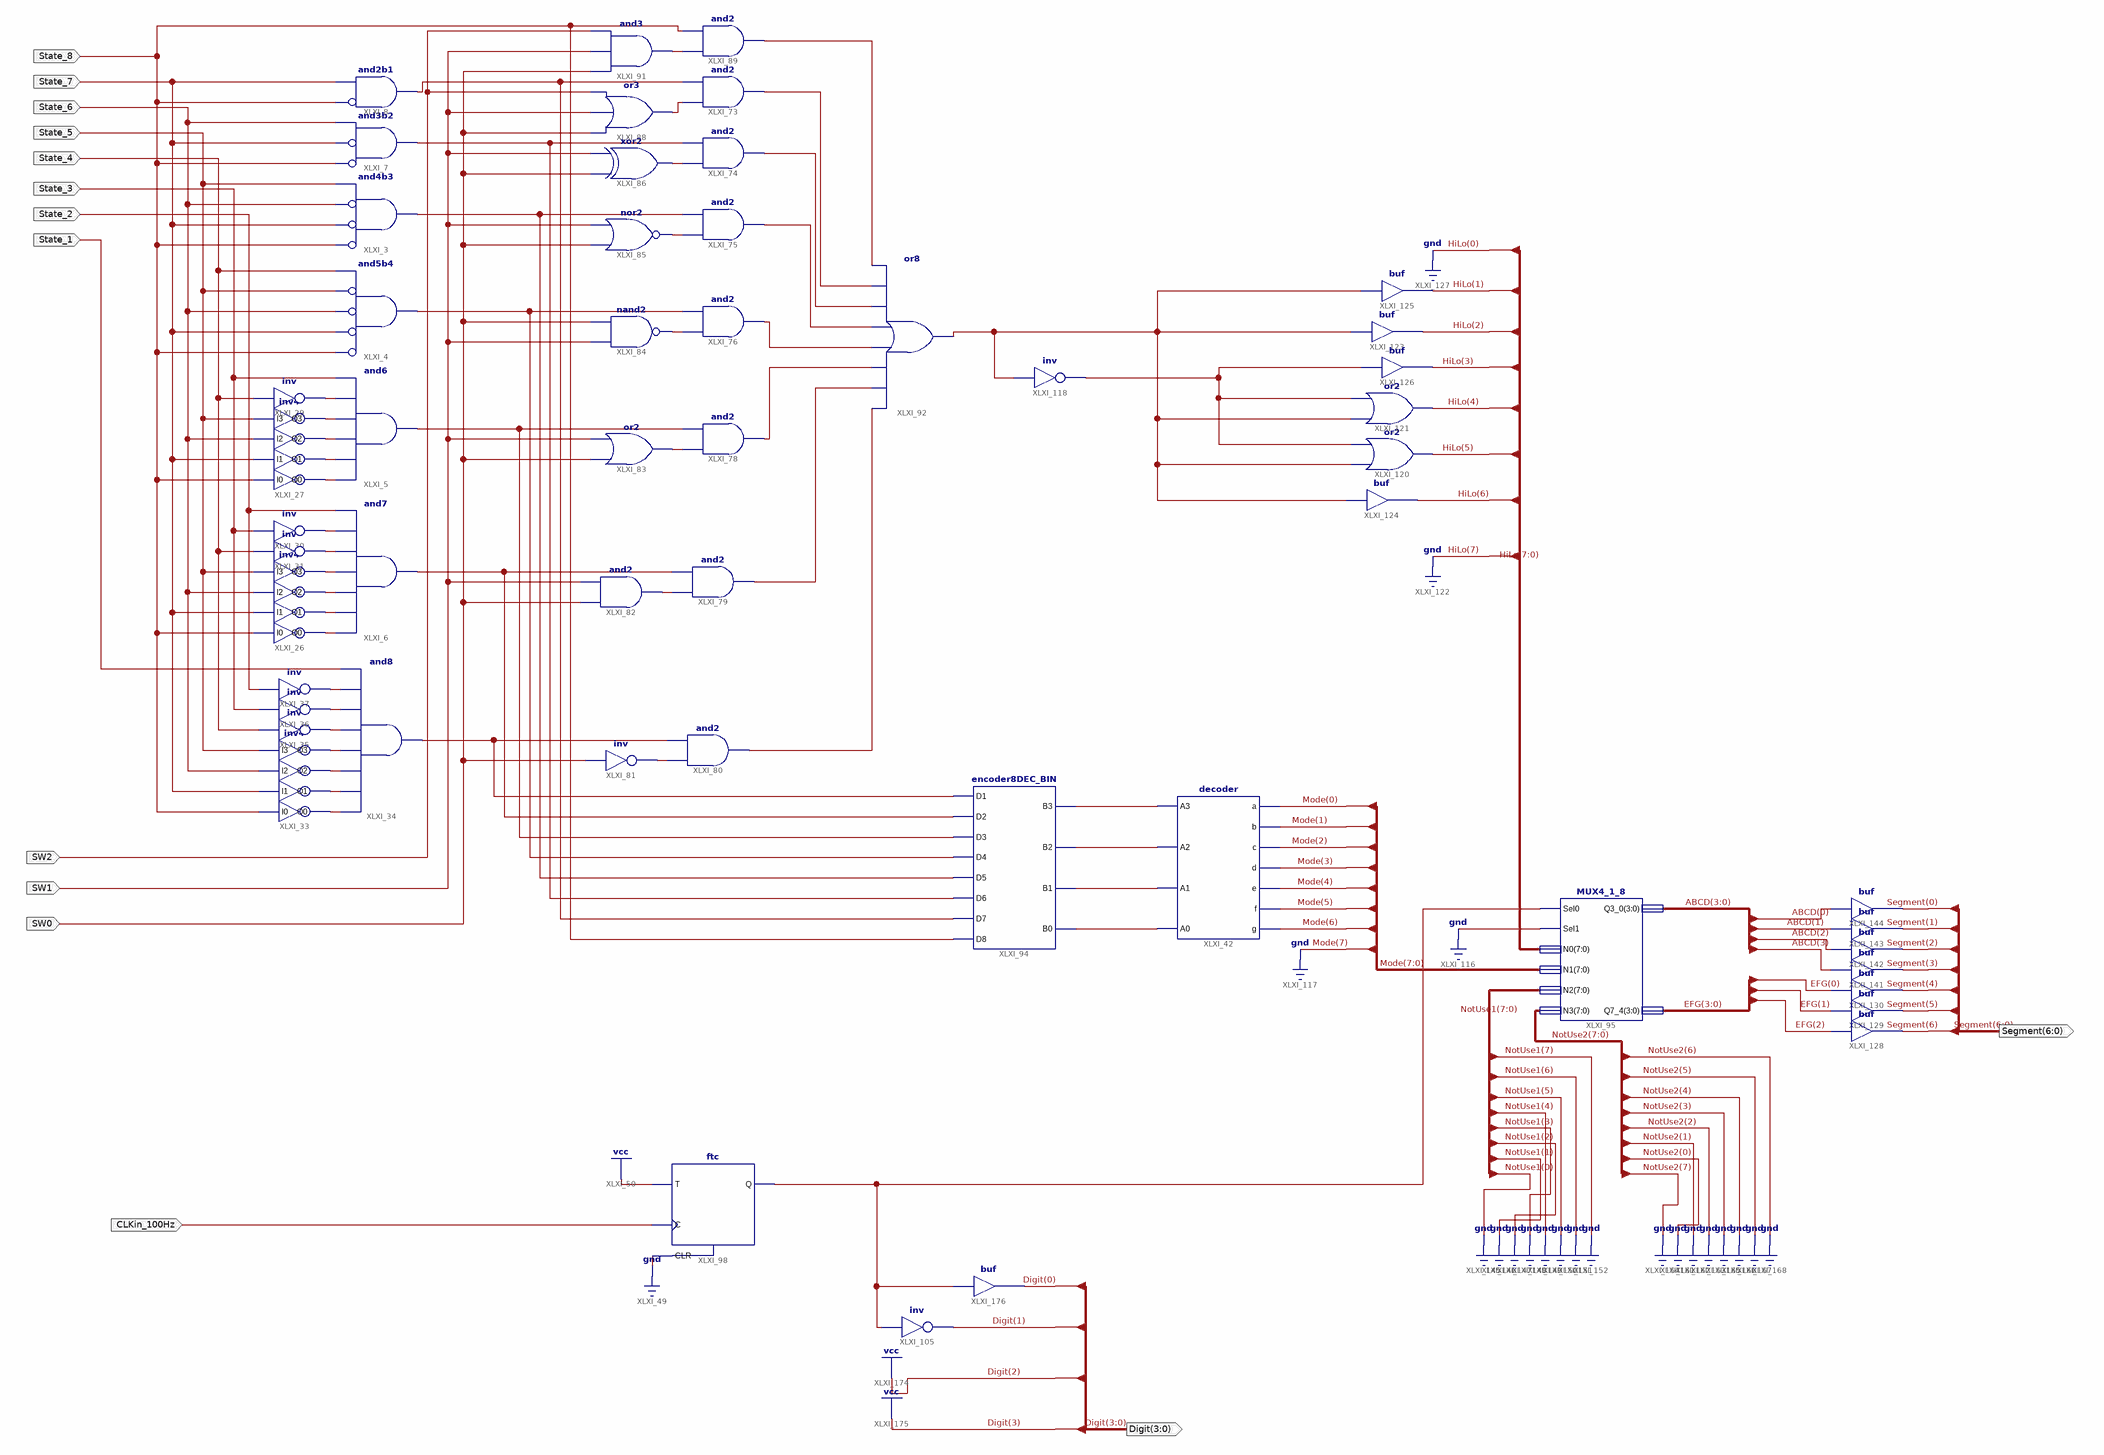
[diagram p0: schematic sheet 1]
// Xilinx ISE schematic BasicLogicGate.sch (spartan6) as structural Verilog: 53 symbols, 14 ports
module BasicLogicGate (
  input  State_4,
  input  State_5,
  input  State_6,
  input  State_8,
  input  State_7,
  input  State_1,
  input  State_2,
  input  State_3,
  input  SW2,
  input  SW1,
  input  CLKin_100Hz,
  input  SW0,
  output [3:0] Digit,
  output [6:0] Segment
);

  wire XLXN_1, XLXN_2, XLXN_3, XLXN_4, XLXN_5, XLXN_6, XLXN_7, XLXN_35, XLXN_40, XLXN_41, XLXN_42, XLXN_68,
       XLXN_69, XLXN_70, XLXN_71, XLXN_72, XLXN_73, XLXN_74, XLXN_186, XLXN_188, XLXN_190, XLXN_191,
       XLXN_196, XLXN_197, XLXN_201, XLXN_214, XLXN_220, XLXN_221, XLXN_222, XLXN_223, XLXN_224, XLXN_225,
       XLXN_226, XLXN_227, XLXN_251, XLXN_252, XLXN_253, XLXN_254, XLXN_328, XLXN_330, XLXN_334, XLXN_335,
       XLXN_336, XLXN_337, XLXN_338, XLXN_339, XLXN_340, XLXN_425;
  wire [3:0] ABCD, EFG;
  wire [6:0] Mode;
  wire [6:1] HiLo;

  and XLXI_3 (XLXN_338, ~State_8, ~State_7, ~State_6, State_5);  // and4b3
  and XLXI_4 (XLXN_337, ~State_8, ~State_7, ~State_6, ~State_5, State_4);  // and5b4
  and XLXI_5 (XLXN_336, XLXN_5, XLXN_6, XLXN_7, XLXN_35, XLXN_40, State_3);
  and XLXI_6 (XLXN_335, XLXN_1, XLXN_2, XLXN_3, XLXN_4, XLXN_42, XLXN_41, State_2);
  and XLXI_7 (XLXN_339, ~State_8, ~State_7, State_6);  // and3b2
  and XLXI_8 (XLXN_340, ~State_8, State_7);  // and2b1
  inv4 XLXI_26 (
    .I0(State_8), .I1(State_7), .I2(State_6), .I3(State_5), .O0(XLXN_1), .O1(XLXN_2), .O2(XLXN_3), .O3(XLXN_4));
  inv4 XLXI_27 (
    .I0(State_8), .I1(State_7), .I2(State_6), .I3(State_5), .O0(XLXN_5), .O1(XLXN_6), .O2(XLXN_7),
    .O3(XLXN_35));
  not XLXI_29 (XLXN_40, State_4);
  not XLXI_30 (XLXN_41, State_3);
  not XLXI_31 (XLXN_42, State_4);
  inv4 XLXI_33 (
    .I0(State_8), .I1(State_7), .I2(State_6), .I3(State_5), .O0(XLXN_68), .O1(XLXN_69), .O2(XLXN_70),
    .O3(XLXN_71));
  and XLXI_34 (XLXN_334, XLXN_68, XLXN_69, XLXN_70, XLXN_71, XLXN_72, XLXN_73, XLXN_74, State_1);
  not XLXI_35 (XLXN_72, State_4);
  not XLXI_36 (XLXN_73, State_3);
  not XLXI_37 (XLXN_74, State_2);
  and XLXI_73 (XLXN_226, XLXN_201, XLXN_340);
  and XLXI_74 (XLXN_225, XLXN_197, XLXN_339);
  and XLXI_75 (XLXN_224, XLXN_196, XLXN_338);
  and XLXI_76 (XLXN_223, XLXN_191, XLXN_337);
  and XLXI_78 (XLXN_222, XLXN_190, XLXN_336);
  and XLXI_79 (XLXN_221, XLXN_188, XLXN_335);
  and XLXI_80 (XLXN_220, XLXN_186, XLXN_334);
  not XLXI_81 (XLXN_186, SW0);
  and XLXI_82 (XLXN_188, SW0, SW1);
  or XLXI_83 (XLXN_190, SW0, SW1);
  nand XLXI_84 (XLXN_191, SW1, SW0);
  nor XLXI_85 (XLXN_196, SW0, SW1);
  xor XLXI_86 (XLXN_197, SW0, SW1);
  or XLXI_88 (XLXN_201, SW0, SW1, SW2);
  and XLXI_89 (XLXN_227, XLXN_214, State_8);
  and XLXI_91 (XLXN_214, SW0, SW1, SW2);
  or XLXI_92 (XLXN_328, XLXN_220, XLXN_221, XLXN_222, XLXN_223, XLXN_224, XLXN_225, XLXN_226, XLXN_227);
  MUX4_1_8 XLXI_95 (
    .Sel0(XLXN_425), .Sel1(1'b0), .N0({1'b0, HiLo, 1'b0}), .N1({1'b0, Mode}), .N2({8{1'b0}}), .N3({8{1'b0}}),
    .Q3_0(ABCD), .Q7_4(EFG));
  ftc XLXI_98 (.C(CLKin_100Hz), .CLR(1'b0), .T(1'b1), .Q(XLXN_425));
  not XLXI_105 (Digit[1], XLXN_425);
  encoder8DEC_BIN XLXI_94 (
    .D1(XLXN_334), .D2(XLXN_335), .D3(XLXN_336), .D4(XLXN_337), .D5(XLXN_338), .D6(XLXN_339), .D7(XLXN_340),
    .D8(State_8), .B0(XLXN_254), .B2(XLXN_252), .B3(XLXN_251), .B1(XLXN_253));
  decoder XLXI_42 (
    .A3(XLXN_251), .A2(XLXN_252), .A1(XLXN_253), .A0(XLXN_254), .a(Mode[0]), .b(Mode[1]), .c(Mode[2]),
    .d(Mode[3]), .e(Mode[4]), .f(Mode[5]), .g(Mode[6]));
  not XLXI_118 (XLXN_330, XLXN_328);
  or XLXI_120 (HiLo[5], XLXN_328, XLXN_330);
  or XLXI_121 (HiLo[4], XLXN_328, XLXN_330);
  buf XLXI_123 (HiLo[2], XLXN_328);
  buf XLXI_124 (HiLo[6], XLXN_328);
  buf XLXI_125 (HiLo[1], XLXN_328);
  buf XLXI_126 (HiLo[3], XLXN_330);
  buf XLXI_130 (Segment[4], EFG[0]);
  buf XLXI_129 (Segment[5], EFG[1]);
  buf XLXI_128 (Segment[6], EFG[2]);
  buf XLXI_141 (Segment[3], ABCD[3]);
  buf XLXI_142 (Segment[2], ABCD[2]);
  buf XLXI_143 (Segment[1], ABCD[1]);
  buf XLXI_144 (Segment[0], ABCD[0]);
  buf XLXI_176 (Digit[0], XLXN_425);

  assign Digit[3:2] = 2'b11;
endmodule
